# EAGLE design Node_PCB_v20234 (EAGLE 9.6.2)
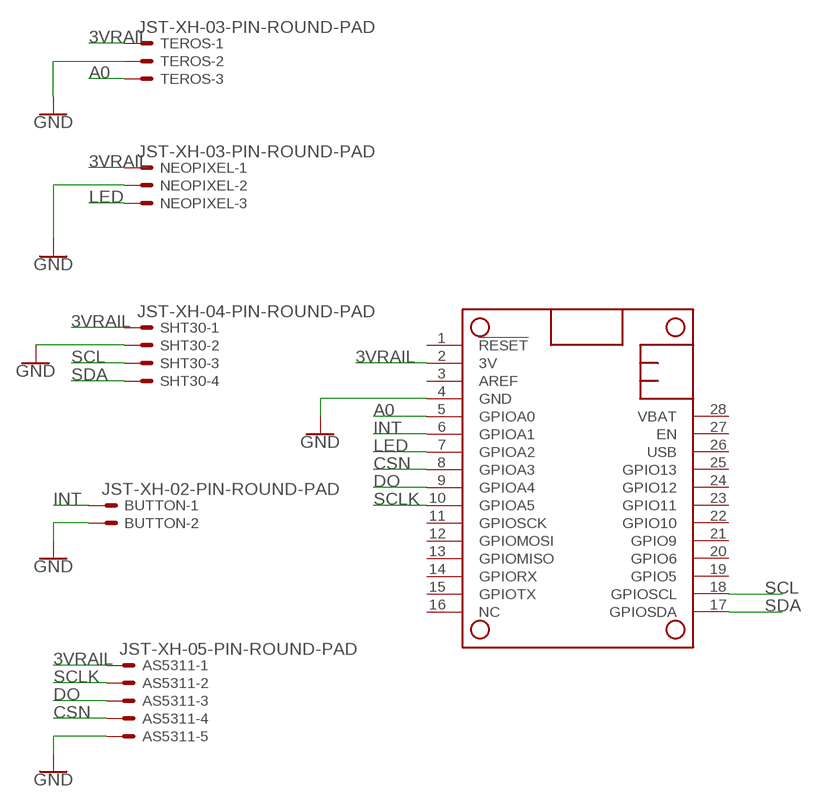
[diagram p0: schematic, sheet 1]

## Parts
AS5311  JST-XH-05-PIN-ROUND-PAD  [JST-XH-05-PACKAGE-ROUND-PAD]
BUTTON  JST-XH-02-PIN-ROUND-PAD  [JST-XH-02-PACKAGE-ROUND-PAD]
MS1  FEATHERWING  [FEATHERWING]
NEOPIXEL  JST-XH-03-PIN-ROUND-PAD  [JST-XH-03-PACKAGE-ROUND-PAD]
SHT30  JST-XH-04-PIN-ROUND-PAD  [JST-XH-04-PACKAGE-ROUND-PAD]
TEROS  JST-XH-03-PIN-ROUND-PAD  [JST-XH-03-PACKAGE-ROUND-PAD]

## Nets
3VRAIL: AS5311.1 MS1.2(3V) NEOPIXEL.1 SHT30.1 TEROS.1
A0: MS1.5(GPIOA0) TEROS.3
CSN: AS5311.4 MS1.8(GPIOA3)
DO: AS5311.3 MS1.9(GPIOA4)
GND: AS5311.5 BUTTON.2 MS1.4(GND) NEOPIXEL.2 SHT30.2 TEROS.2
INT: BUTTON.1 MS1.6(GPIOA1)
LED: MS1.7(GPIOA2) NEOPIXEL.3
SCL: MS1.18(GPIOSCL) SHT30.3
SCLK: AS5311.2 MS1.10(GPIOA5)
SDA: MS1.17(GPIOSDA) SHT30.4
Unconnected: MS1.1(!RESET) MS1.3(AREF) MS1.11(GPIOSCK) MS1.12(GPIOMOSI) MS1.13(GPIOMISO) MS1.14(GPIORX) MS1.15(GPIOTX) MS1.16(NC) MS1.19(GPIO5) MS1.20(GPIO6) MS1.21(GPIO9) MS1.22(GPIO10) MS1.23(GPIO11) MS1.24(GPIO12) MS1.25(GPIO13) MS1.26(USB) MS1.27(EN) MS1.28(VBAT)

## Library data of the parts
AS5311 = Rembrandt Electronics - JST XH Connectors v1-0:JST-XH-05-PIN: JST XH Connector 2 Pin Wire to board connector. Pitch: 2,54 mm, (0.100") Number of pins: 5 Created by Rembrandt Electronics www.rembrandtelectronics.com
BUTTON = Rembrandt Electronics - JST XH Connectors v1-0:JST-XH-02-PIN: JST XH Connector 2 Pin Wire to board connector. Pitch: 2,54 mm, (0.100") Number of pins: 2 Created by Rembrandt Electronics www.rembrandtelectronics.com
MS1 = modifiedAdafruit:FEATHERWING
NEOPIXEL TEROS = Rembrandt Electronics - JST XH Connectors v1-0:JST-XH-03-PIN: JST XH Connector 2 Pin Wire to board connector. Pitch: 2,54 mm, (0.100") Number of pins: 3 Created by Rembrandt Electronics www.rembrandtelectronics.com
SHT30 = Rembrandt Electronics - JST XH Connectors v1-0:JST-XH-04-PIN: JST XH Connector 2 Pin Wire to board connector. Pitch: 2,54 mm, (0.100") Number of pins: 4 Created by Rembrandt Electronics www.rembrandtelectronics.com

## Net classes
0 default: clearance 0.152 mm

## Board
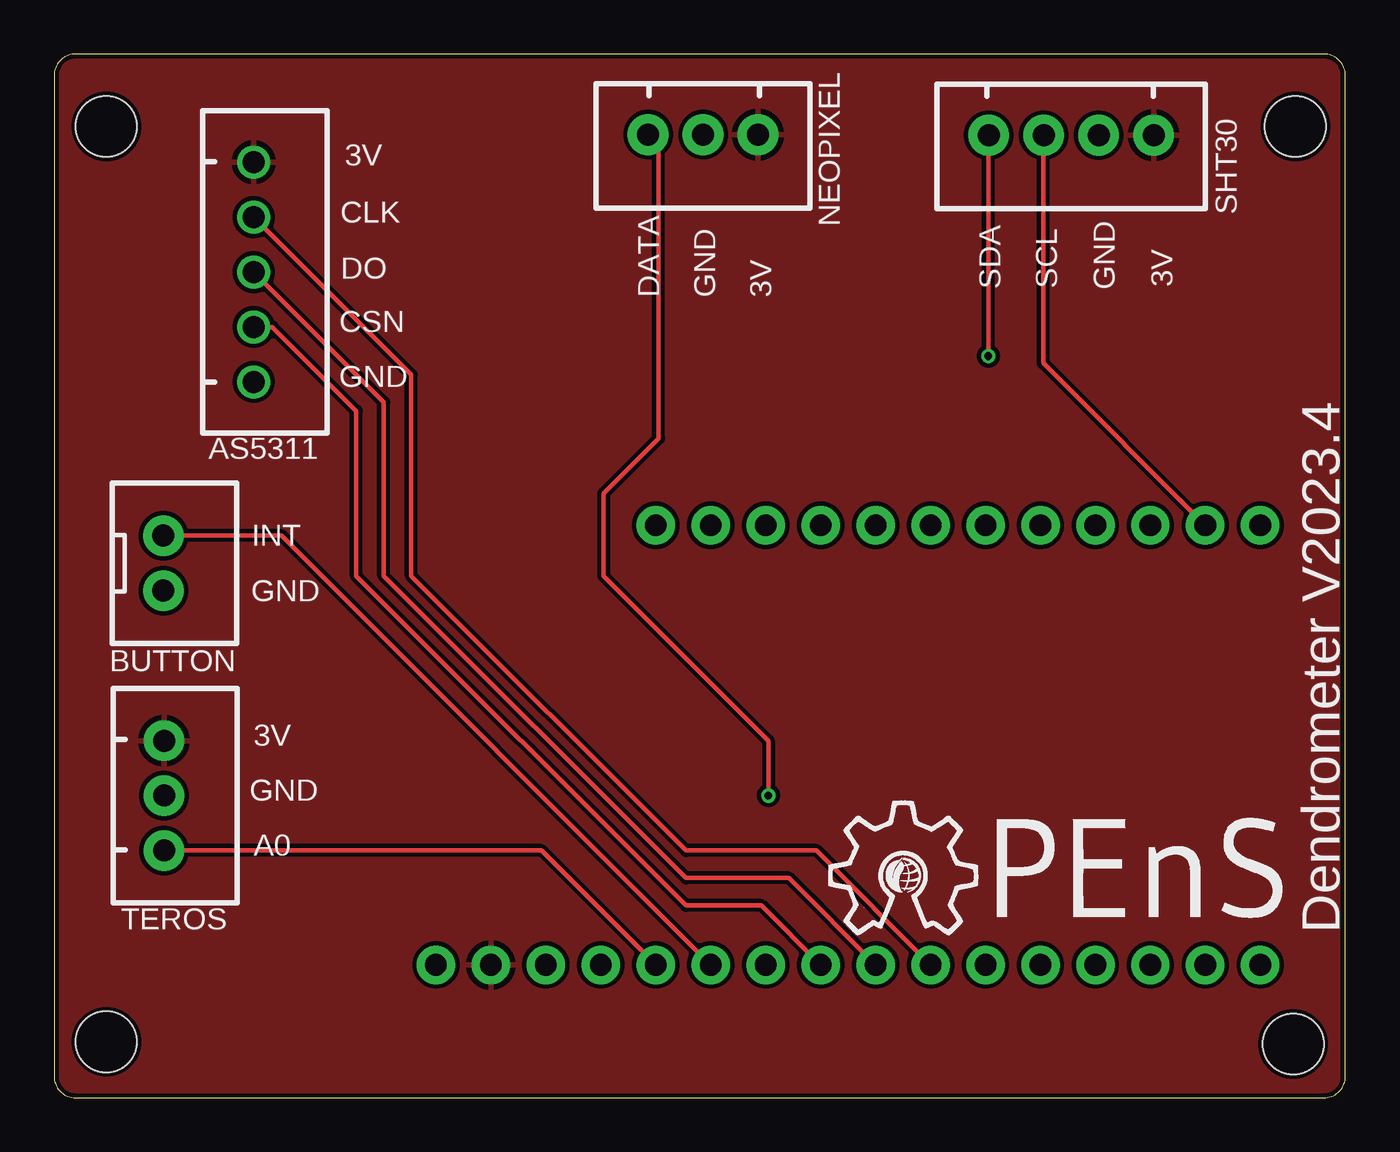
[diagram p1: board, top side]
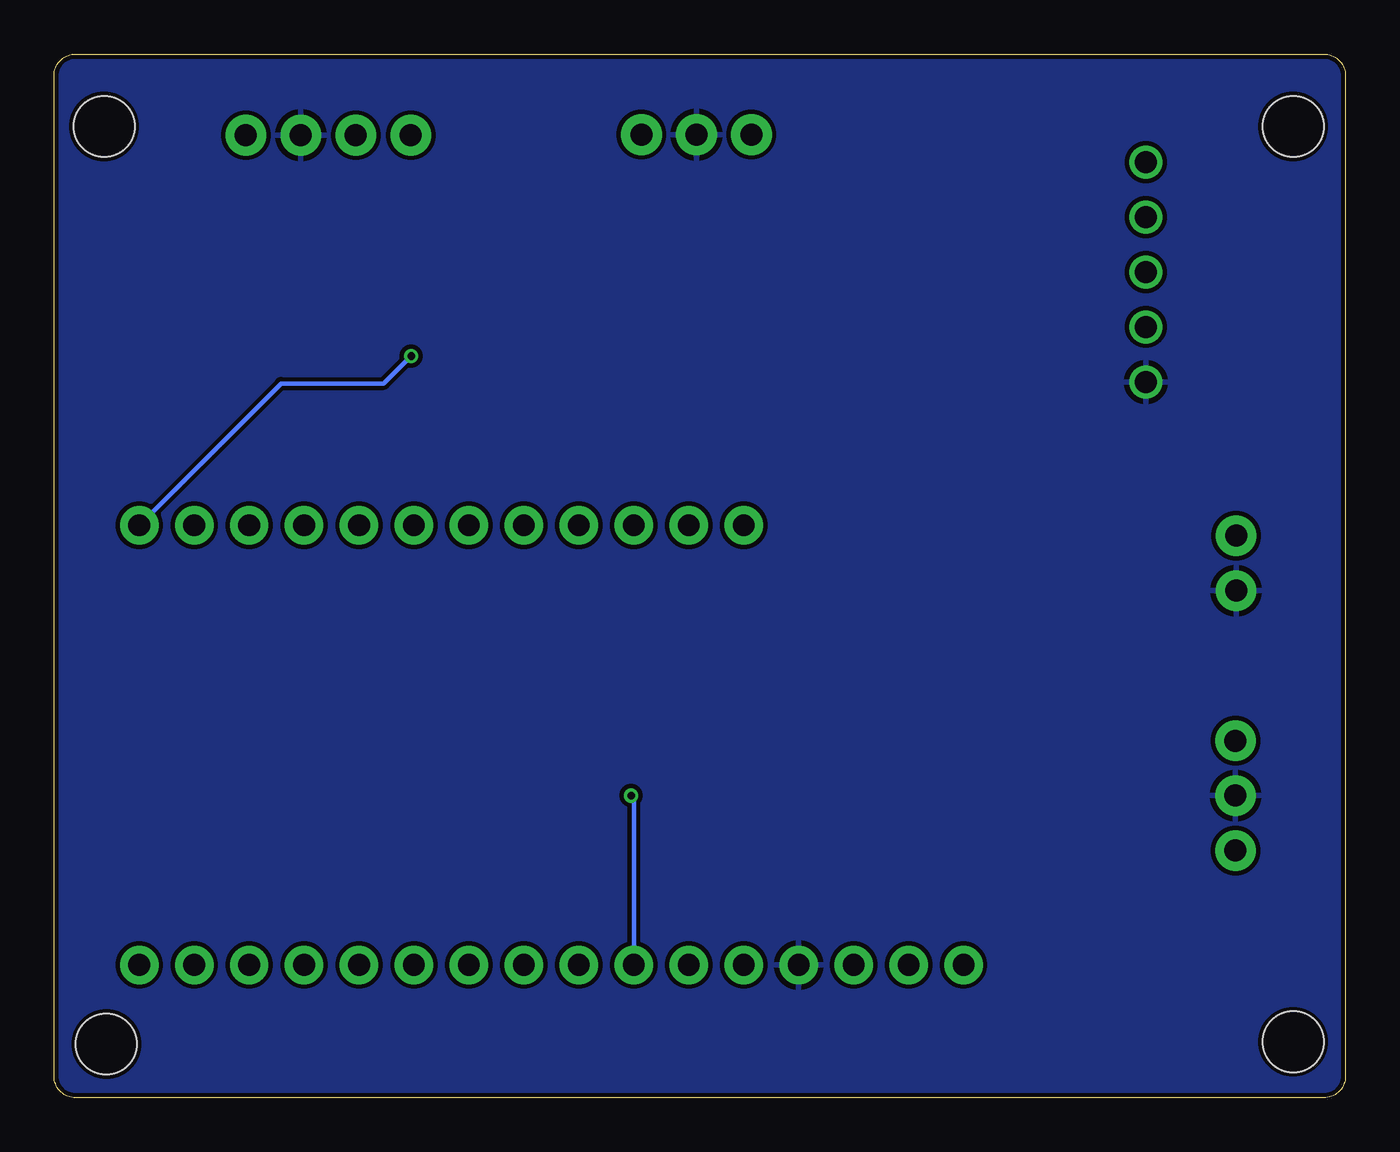
[diagram p2: board, bottom side, seen from below]

Size 59.69 x 48.25 mm. Coordinates in mm from the lower left corner, seen from the top.
Outline: 0,47.25 0,1 arc90 1,0 58.69,0 arc90 59.69,1 59.69,47.25 arc90 58.69,48.25 1,48.25 arc90 0,47.25
Copper layers (1*16): Top 0.035mm / dielectric 1.5mm / Bottom 0.035mm
Design rules "SparkFun *": minimum track width 6mil, minimum drill 0.2mm, track to track 8mil, track to pad 8mil, pad to pad 8mil, via to via 8mil, smd to smd 8mil, copper to edge 8mil, drill to drill 8mil, minimum pad ring 6mil, minimum via ring 6mil, stop-mask expansion 4mil, vias tented up to drill 20mil, thermal gap 10mil
Holes 2.8 mm at 2.41,2.59 57.38,44.91 57.28,2.49 2.41,44.91

### Footprints (pad centres in the part's own frame; a part is rotated, then mirrored left to right if it is on the bottom)
JST-XH-05-PACKAGE-ROUND-PAD = drill 1.016: 1 -5.08,0; 2 -2.54,0; 3 0,0; 4 2.54,0; 5 5.08,0
JST-XH-02-PACKAGE-ROUND-PAD = drill 1.016 pad 1.88: 1 -1.27,0; 2 1.27,0
FEATHERWING = drill 1 pad 1.778: 1 6.35,1.27; 2 8.89,1.27; 3 11.43,1.27; 4 13.97,1.27; 5 16.51,1.27; 6 19.05,1.27; 7 21.59,1.27; 8 24.13,1.27; 9 26.67,1.27; 10 29.21,1.27; 11 31.75,1.27; 12 34.29,1.27; 13 36.83,1.27; 14 39.37,1.27; 15 41.91,1.27; 16 44.45,1.27; 17 44.45,21.59; 18 41.91,21.59; 19 39.37,21.59; 20 36.83,21.59; 21 34.29,21.59; 22 31.75,21.59; 23 29.21,21.59; 24 26.67,21.59; 25 24.13,21.59; 26 21.59,21.59; 27 19.05,21.59; 28 16.51,21.59
JST-XH-03-PACKAGE-ROUND-PAD = drill 1.016 pad 1.88: 1 -2.54,0; 2 0,0; 3 2.54,0
JST-XH-04-PACKAGE-ROUND-PAD = drill 1.016 pad 1.88: 1 -3.81,0; 2 -1.27,0; 3 1.27,0; 4 3.81,0

### Placement (x,y rotation side)
AS5311  9.22,38.18 270 top
BUTTON  5.05,24.71 270 top
MS1  11.3,4.88 0 top
NEOPIXEL  30,44.53 180 top
SHT30  47.02,44.5 180 top
TEROS  5.08,13.97 270 top
U$1  [OPENS-LOGO]  35.56,3.81 0 top

### Tracks (layer width: path | path; a pad name or v marks a point on that pad's centre or on a via)
3VRAIL
  pour Top: 0,0 59.69,0 59.69,48.26 0,48.26
A0
  Top 0.2: MS1.5 22.53,11.43 TEROS.3
CSN
  Top 0.2: MS1.8 32.69,8.89 29.21,8.89 13.97,24.13 13.97,31.75 10.08,35.64 AS5311.4
DO
  Top 0.2: MS1.9 33.96,10.16 29.21,10.16 15.24,24.13 15.24,32.16 AS5311.3
GND
  pour Bottom: 0,0 59.69,0 59.69,48.26 0,48.26
INT
  Top 0.2: BUTTON.1 10.52,25.98 MS1.6
LED  (via drill 0.35)
  Top 0.2: NEOPIXEL.3 27.94,44.04 27.94,30.48 25.4,27.94 25.4,24.13 33.02,16.51 v33.02,13.97
  Bottom 0.2: MS1.7 32.89,13.84 v33.02,13.97
SCL
  Top 0.2: MS1.18 45.72,33.96 45.72,44.47 SHT30.3
SCLK
  Top 0.2: MS1.10 35.23,11.43 29.21,11.43 16.51,24.13 16.51,33.43 AS5311.2
SDA  (via drill 0.35)
  Top 0.2: v43.18,34.29 43.18,44.47 SHT30.4
  Bottom 0.2: MS1.17 49.2,33.02 44.45,33.02 v43.18,34.29

### Text on the board
tPlace: Dendrometer V2023.4
tNames: 3V | CLK | DO | SDA | SCL | GND | 3V | CSN | DATA | GND | 3V | GND | INT | GND | 3V | GND | A0